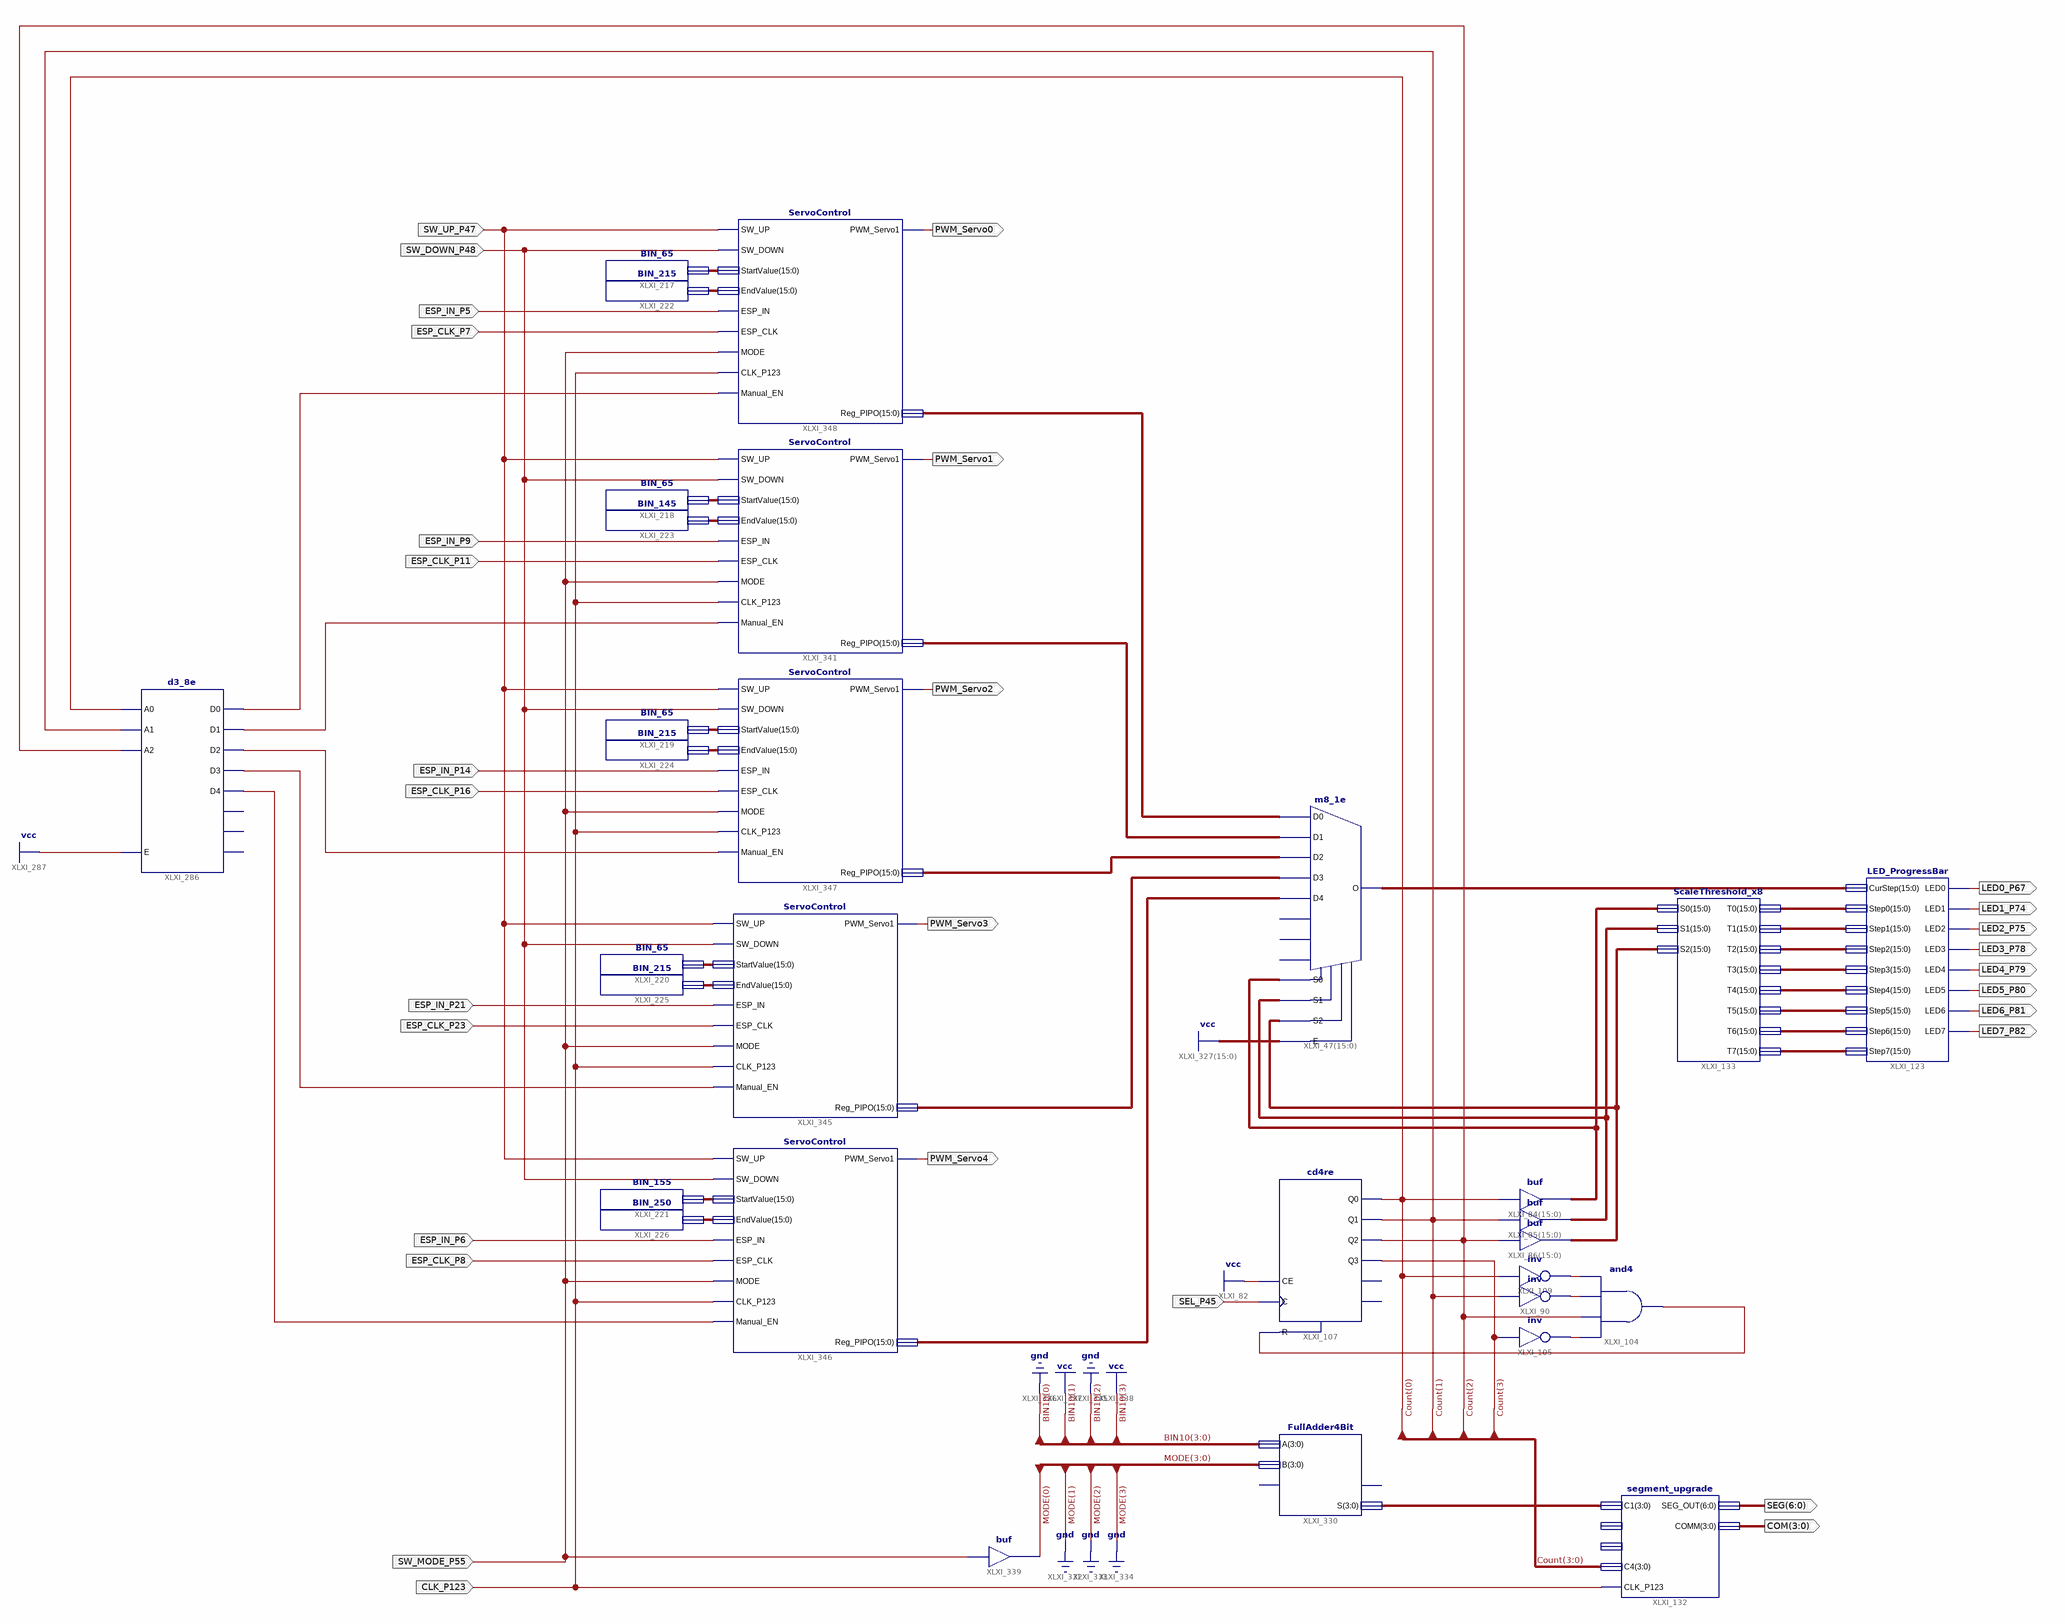
[diagram p0: schematic sheet 1]
// Xilinx ISE schematic main.sch (spartan6) as structural Verilog: 30 symbols, 30 ports
module main (
  input  SEL_P45,
  input  CLK_P123,
  input  SW_DOWN_P48,
  input  SW_UP_P47,
  input  ESP_IN_P6,
  input  ESP_CLK_P8,
  input  ESP_CLK_P23,
  input  ESP_IN_P21,
  input  ESP_CLK_P16,
  input  ESP_IN_P14,
  input  ESP_CLK_P11,
  input  ESP_IN_P9,
  input  ESP_CLK_P7,
  input  ESP_IN_P5,
  input  SW_MODE_P55,
  output LED0_P67,
  output LED1_P74,
  output LED2_P75,
  output LED3_P78,
  output LED4_P79,
  output LED5_P80,
  output LED6_P81,
  output LED7_P82,
  output PWM_Servo0,
  output PWM_Servo1,
  output PWM_Servo2,
  output PWM_Servo3,
  output PWM_Servo4,
  output [6:0] SEG,
  output [3:0] COM
);

  wire XLXN_473, XLXN_477, XLXN_500, XLXN_503, XLXN_1266, XLXN_1267, XLXN_1268, XLXN_1269, XLXN_1270;
  wire [0:0] MODE;
  wire [3:0] Count, XLXN_1297;
  wire [15:0] RegPIPO, XLXN_449, XLXN_450, XLXN_756, XLXN_757, XLXN_758, XLXN_759, XLXN_760, XLXN_761,
       XLXN_762, XLXN_763, XLXN_1037, XLXN_1038, XLXN_1039, XLXN_1040, XLXN_1041, XLXN_1077, XLXN_1080,
       XLXN_1081, XLXN_1082, XLXN_1085, XLXN_1086, XLXN_1280, XLXN_1281, XLXN_1282, XLXN_1283, XLXN_1284;

  LED_ProgressBar XLXI_123 (
    .CurStep(RegPIPO), .LED0(LED0_P67), .LED1(LED1_P74), .LED2(LED2_P75), .LED3(LED3_P78), .LED4(LED4_P79),
    .LED5(LED5_P80), .LED6(LED6_P81), .LED7(LED7_P82), .Step0(XLXN_756), .Step1(XLXN_757), .Step2(XLXN_758),
    .Step3(XLXN_759), .Step4(XLXN_760), .Step5(XLXN_761), .Step6(XLXN_762), .Step7(XLXN_763));
  not XLXI_109 (XLXN_503, Count[0]);
  not XLXI_90 (XLXN_473, Count[1]);
  cd4re XLXI_107 (
    .C(SEL_P45), .CE(1'b1), .R(XLXN_477), .Q0(Count[0]), .Q1(Count[1]), .Q2(Count[2]), .Q3(Count[3]));  // open: CEO, TC
  not XLXI_105 (XLXN_500, Count[3]);
  and XLXI_104 (XLXN_477, XLXN_500, Count[2], XLXN_473, XLXN_503);
  assign XLXN_449 = {16{Count[1]}};  // buf XLXI_85[15..0], 16 bits wide
  assign XLXN_450 = {16{Count[2]}};  // buf XLXI_86[15..0], 16 bits wide
  m8_1e XLXI_47[15:0] (
    .D0(XLXN_1037), .D1(XLXN_1038), .D2(XLXN_1039), .D3(XLXN_1040), .D4(XLXN_1041), .E({16{1'b1}}),
    .S0(XLXN_1280), .S1(XLXN_449), .S2(XLXN_450), .O(RegPIPO));  // open: D5, D6, D7
  ScaleThreshold_x8 XLXI_133 (
    .S0(XLXN_1280), .S1(XLXN_449), .S2(XLXN_450), .T0(XLXN_756), .T1(XLXN_757), .T2(XLXN_758), .T3(XLXN_759),
    .T4(XLXN_760), .T5(XLXN_761), .T6(XLXN_762), .T7(XLXN_763));
  assign XLXN_1280 = {16{Count[0]}};  // buf XLXI_84[15..0], 16 bits wide
  d3_8e XLXI_286 (
    .A0(Count[0]), .A1(Count[1]), .A2(Count[2]), .E(1'b1), .D0(XLXN_1266), .D1(XLXN_1267), .D2(XLXN_1268),
    .D3(XLXN_1269), .D4(XLXN_1270));  // open: D5, D6, D7
  BIN_250 XLXI_226 (.OUTPUT(XLXN_1086));
  BIN_155 XLXI_221 (.OUTPUT(XLXN_1081));
  BIN_215 XLXI_225 (.OUTPUT(XLXN_1085));
  BIN_65 XLXI_220 (.OUTPUT(XLXN_1080));
  BIN_215 XLXI_224 (.OUTPUT(XLXN_1284));
  BIN_65 XLXI_219 (.OUTPUT(XLXN_1283));
  BIN_145 XLXI_223 (.OUTPUT(XLXN_1282));
  BIN_65 XLXI_218 (.OUTPUT(XLXN_1281));
  BIN_215 XLXI_222 (.OUTPUT(XLXN_1082));
  BIN_65 XLXI_217 (.OUTPUT(XLXN_1077));
  FullAdder4Bit XLXI_330 (.A(4'b1010), .B({3'b000, MODE[0]}), .S(XLXN_1297));  // open: CI, CO
  segment_upgrade XLXI_132 (
    .CLK_P123(CLK_P123), .C1(XLXN_1297), .C4(Count), .SEG_OUT(SEG), .COMM(COM));  // open: C2, C3
  buf XLXI_339 (MODE[0], SW_MODE_P55);
  ServoControl XLXI_341 (
    .ESP_IN(ESP_IN_P9), .CLK_P123(CLK_P123), .ESP_CLK(ESP_CLK_P11), .SW_UP(SW_UP_P47), .SW_DOWN(SW_DOWN_P48),
    .StartValue(XLXN_1281), .EndValue(XLXN_1282), .Manual_EN(XLXN_1267), .MODE(SW_MODE_P55),
    .PWM_Servo1(PWM_Servo1), .Reg_PIPO(XLXN_1038));
  ServoControl XLXI_345 (
    .ESP_IN(ESP_IN_P21), .CLK_P123(CLK_P123), .ESP_CLK(ESP_CLK_P23), .SW_UP(SW_UP_P47),
    .SW_DOWN(SW_DOWN_P48), .StartValue(XLXN_1080), .EndValue(XLXN_1085), .Manual_EN(XLXN_1269),
    .MODE(SW_MODE_P55), .PWM_Servo1(PWM_Servo3), .Reg_PIPO(XLXN_1040));
  ServoControl XLXI_346 (
    .ESP_IN(ESP_IN_P6), .CLK_P123(CLK_P123), .ESP_CLK(ESP_CLK_P8), .SW_UP(SW_UP_P47), .SW_DOWN(SW_DOWN_P48),
    .StartValue(XLXN_1081), .EndValue(XLXN_1086), .Manual_EN(XLXN_1270), .MODE(SW_MODE_P55),
    .PWM_Servo1(PWM_Servo4), .Reg_PIPO(XLXN_1041));
  ServoControl XLXI_347 (
    .ESP_IN(ESP_IN_P14), .CLK_P123(CLK_P123), .ESP_CLK(ESP_CLK_P16), .SW_UP(SW_UP_P47),
    .SW_DOWN(SW_DOWN_P48), .StartValue(XLXN_1283), .EndValue(XLXN_1284), .Manual_EN(XLXN_1268),
    .MODE(SW_MODE_P55), .PWM_Servo1(PWM_Servo2), .Reg_PIPO(XLXN_1039));
  ServoControl XLXI_348 (
    .ESP_IN(ESP_IN_P5), .CLK_P123(CLK_P123), .ESP_CLK(ESP_CLK_P7), .SW_UP(SW_UP_P47), .SW_DOWN(SW_DOWN_P48),
    .StartValue(XLXN_1077), .EndValue(XLXN_1082), .Manual_EN(XLXN_1266), .MODE(SW_MODE_P55),
    .PWM_Servo1(PWM_Servo0), .Reg_PIPO(XLXN_1037));

  // Notes on the sheet:
  //   CLOCK_DEDICATED_ROUTE on signal SEL_P45 = True
  //   CLOCK_DEDICATED_ROUTE on signal SW_DOWN_P48 = True
  //   CLOCK_DEDICATED_ROUTE on signal SW_UP_P47 = True
  //   CLOCK_DEDICATED_ROUTE on signal ESP_CLK_P8 = True
  //   CLOCK_DEDICATED_ROUTE on signal ESP_CLK_P23 = True
  //   CLOCK_DEDICATED_ROUTE on signal ESP_CLK_P16 = True
  //   CLOCK_DEDICATED_ROUTE on signal ESP_CLK_P11 = True
  //   CLOCK_DEDICATED_ROUTE on signal ESP_CLK_P7 = True
endmodule
